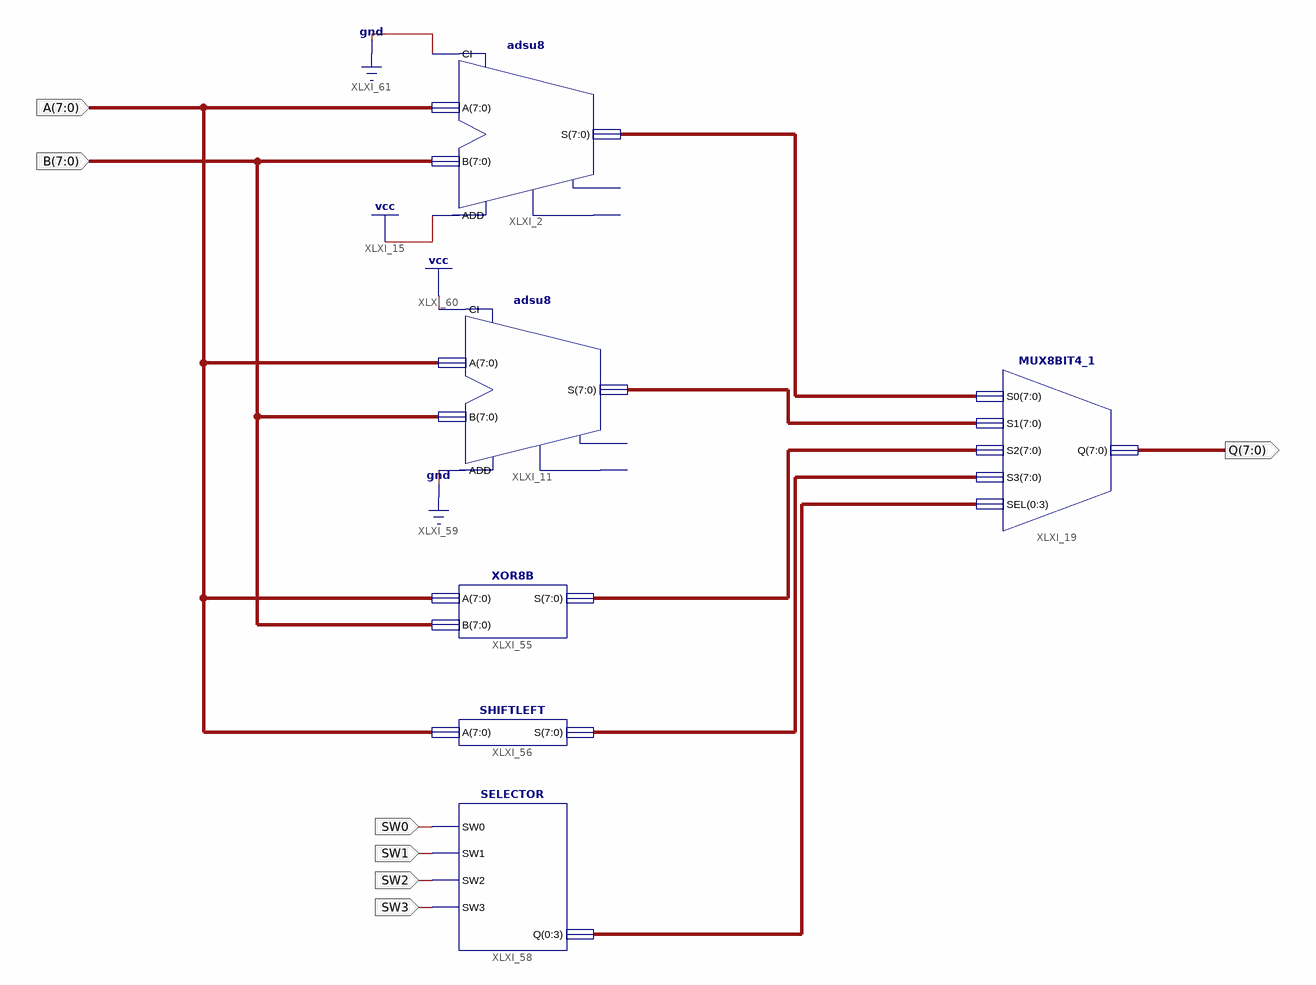
[diagram p0: schematic sheet 1]
// Xilinx ISE schematic ALU.sch (spartan6) as structural Verilog: 6 symbols, 7 ports
module ALU (
  input  [7:0] B,
  input  [7:0] A,
  input  SW0,
  input  SW1,
  input  SW2,
  input  SW3,
  output [7:0] Q
);

  wire [3:0] XLXN_70;
  wire [7:0] XLXN_8, XLXN_9, XLXN_10, XLXN_65;

  adsu8 XLXI_2 (.A(A), .ADD(1'b1), .B(B), .CI(1'b0), .S(XLXN_8));  // open: CO, OFL
  adsu8 XLXI_11 (.A(A), .ADD(1'b0), .B(B), .CI(1'b1), .S(XLXN_9));  // open: CO, OFL
  MUX8BIT4_1 XLXI_19 (.S0(XLXN_8), .S1(XLXN_9), .S2(XLXN_10), .S3(XLXN_65), .SEL(XLXN_70), .Q(Q));
  XOR8B XLXI_55 (.A(A), .B(B), .S(XLXN_10));
  SHIFTLEFT XLXI_56 (.A(A), .S(XLXN_65));
  SELECTOR XLXI_58 (.SW0(SW0), .SW1(SW1), .SW2(SW2), .SW3(SW3), .Q(XLXN_70));
endmodule
